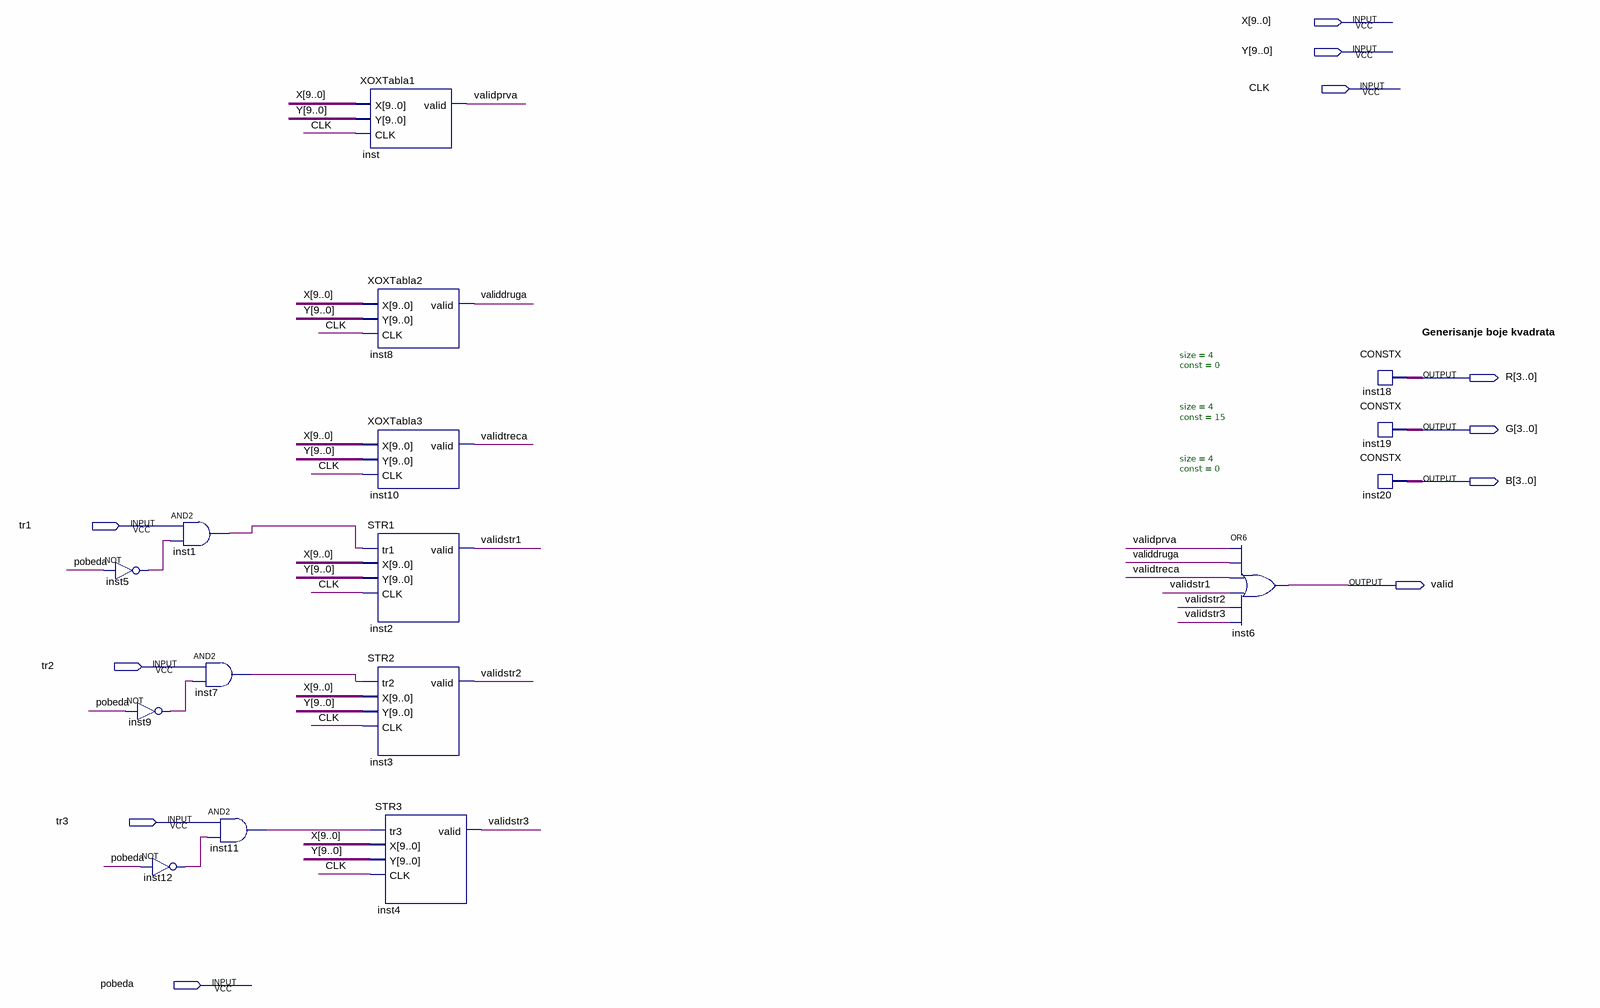
[diagram p0: schematic sheet]
// Quartus schematic Layer1.bdf as structural Verilog: 16 symbols, 11 pins
module Layer1 (
  input  [9:0] X,
  input  [9:0] Y,
  input  CLK,
  input  tr1,
  input  tr2,
  input  tr3,
  input  pobeda,
  output [3:0] R,
  output [3:0] G,
  output [3:0] B,
  output valid
);

  wire inst1_out, inst5_out, inst7_out, inst9_out, inst11_out, inst12_out, validdruga, validprva, validstr1,
       validstr2, validstr3, validtreca;

  not inst5 (inst5_out, pobeda);
  not inst9 (inst9_out, pobeda);
  not inst12 (inst12_out, pobeda);
  and inst1 (inst1_out, tr1, inst5_out);
  and inst7 (inst7_out, tr2, inst9_out);
  and inst11 (inst11_out, tr3, inst12_out);
  XOXTabla1 inst (.X(X), .Y(Y), .CLK(CLK), .valid(validprva));
  XOXTabla2 inst8 (.X(X), .Y(Y), .CLK(CLK), .valid(validdruga));
  XOXTabla3 inst10 (.X(X), .Y(Y), .CLK(CLK), .valid(validtreca));
  STR1 inst2 (.tr1(inst1_out), .X(X), .Y(Y), .CLK(CLK), .valid(validstr1));
  STR2 inst3 (.tr2(inst7_out), .X(X), .Y(Y), .CLK(CLK), .valid(validstr2));
  STR3 inst4 (.tr3(inst11_out), .X(X), .Y(Y), .CLK(CLK), .valid(validstr3));
  or inst6 (valid, validprva, validdruga, validtreca, validstr1, validstr2, validstr3);
  CONSTX #(.size(4), .\const (0)) inst18 (.data(R));
  CONSTX #(.size(4), .\const (15)) inst19 (.data(G));
  CONSTX #(.size(4), .\const (0)) inst20 (.data(B));

  // Notes on the sheet:
  //   Generisanje boje kvadrata
endmodule
